# Altium schematic sheet connector_to_BMS_extension.SchDoc: foxBMS BMS-Master
size A3; DocumentNumber: 24; SheetNumber: 24; SheetTotal: 24; Author: Fraunhofer IISB foxBMS Team; REL-DATE: 2017-05-16; VERSION: 1.0.2; SheetDescription: Connectors to BMS-Extension
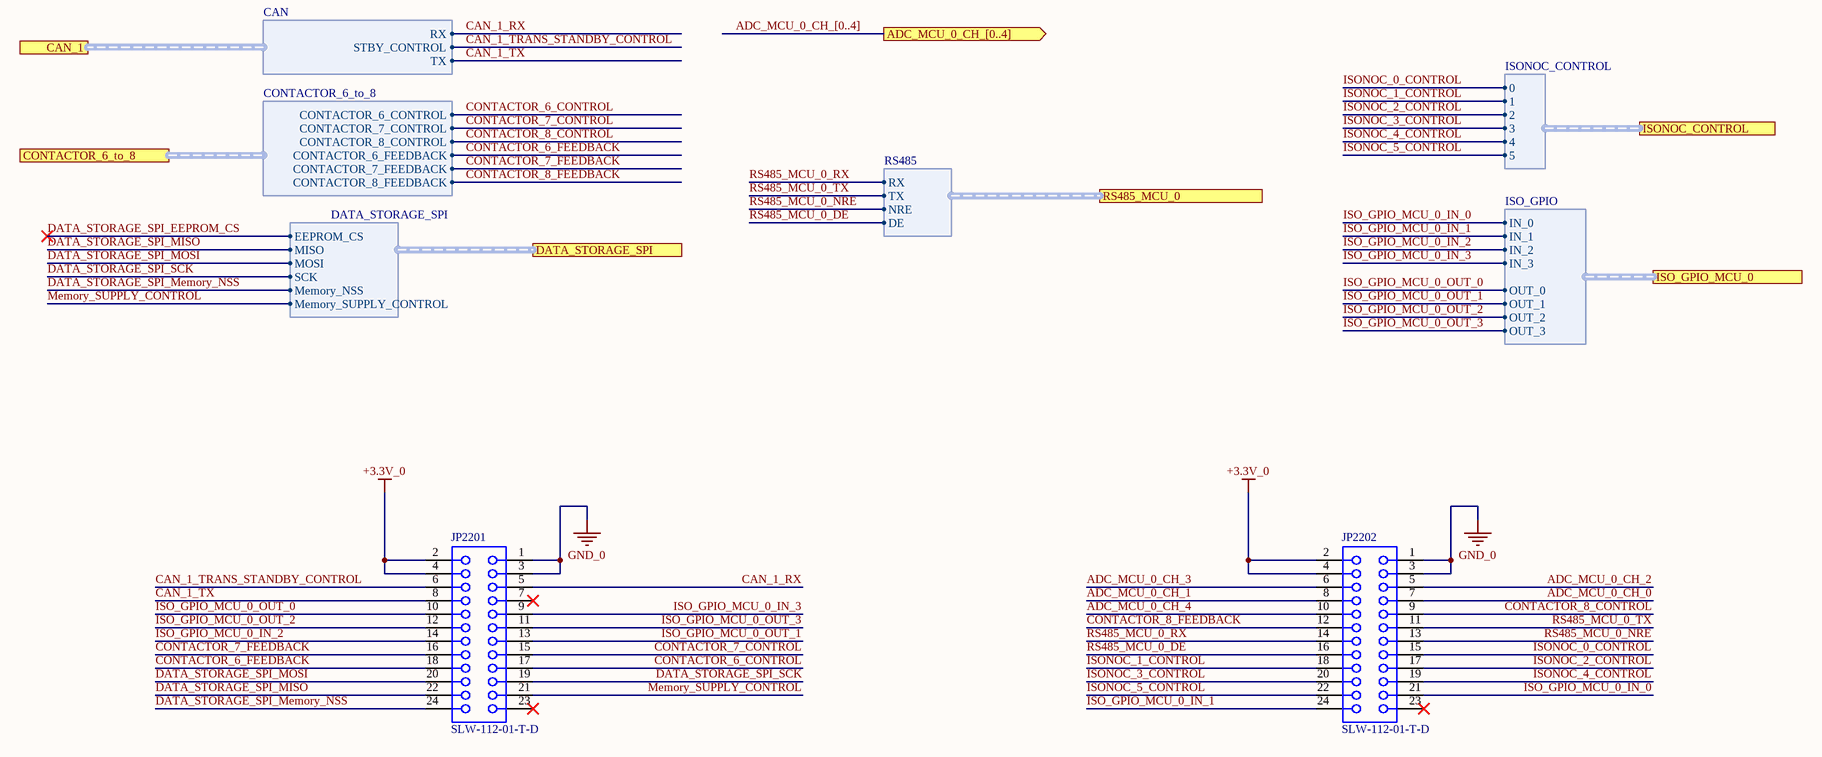
[diagram p0: connector_to_BMS_extension.SchDoc]

## Parts
JP2201  SLW-112-01-T-D  [SMTC-SLW-112-01-X-D]
JP2202  SLW-112-01-T-D  [SMTC-SLW-112-01-X-D]

## Ports
ADC_MCU_0_CH_[0..4] (out), CAN_1 (harness CAN), CONTACTOR_6_to_8 (harness CONTACTOR_6_to_8), DATA_STORAGE_SPI (harness DATA_STORAGE_SPI), ISO_GPIO_MCU_0 (harness ISO_GPIO), ISONOC_CONTROL (harness ISONOC_CONTROL), RS485_MCU_0 (harness RS485)

## Harnesses
CAN: RX, STBY_CONTROL, TX
CONTACTOR_6_to_8: CONTACTOR_6_CONTROL, CONTACTOR_7_CONTROL, CONTACTOR_8_CONTROL, CONTACTOR_6_FEEDBACK, CONTACTOR_7_FEEDBACK, CONTACTOR_8_FEEDBACK
DATA_STORAGE_SPI: EEPROM_CS, MISO, MOSI, SCK, Memory_NSS, Memory_SUPPLY_CONTROL
RS485: RX, TX, NRE, DE
ISONOC_CONTROL: 0, 1, 2, 3, 4, 5
ISO_GPIO: IN_0, IN_1, IN_2, IN_3, OUT_3, OUT_0, OUT_1, OUT_2

## Nets
+3.3V_0: JP2201.2 JP2201.4 JP2202.2 JP2202.4
GND_0: JP2201.1 JP2201.3 JP2202.1 JP2202.3
ADC_MCU_0_CH_0: JP2202.7
ADC_MCU_0_CH_1: JP2202.8
ADC_MCU_0_CH_2: JP2202.5
ADC_MCU_0_CH_3: JP2202.6
ADC_MCU_0_CH_4: JP2202.10
CAN_1_RX: JP2201.5 ; port CAN_1.RX
CAN_1_TRANS_STANDBY_CONTROL: JP2201.6 ; port CAN_1.STBY_CONTROL
CAN_1_TX: JP2201.8 ; port CAN_1.TX
CONTACTOR_6_CONTROL: JP2201.17 ; port CONTACTOR_6_to_8.CONTACTOR_6_CONTROL
CONTACTOR_6_FEEDBACK: JP2201.18 ; port CONTACTOR_6_to_8.CONTACTOR_6_FEEDBACK
CONTACTOR_7_CONTROL: JP2201.15 ; port CONTACTOR_6_to_8.CONTACTOR_7_CONTROL
CONTACTOR_7_FEEDBACK: JP2201.16 ; port CONTACTOR_6_to_8.CONTACTOR_7_FEEDBACK
CONTACTOR_8_CONTROL: JP2202.9 ; port CONTACTOR_6_to_8.CONTACTOR_8_CONTROL
CONTACTOR_8_FEEDBACK: JP2202.12 ; port CONTACTOR_6_to_8.CONTACTOR_8_FEEDBACK
DATA_STORAGE_SPI_EEPROM_CS: port DATA_STORAGE_SPI.EEPROM_CS
DATA_STORAGE_SPI_Memory_NSS: JP2201.24 ; port DATA_STORAGE_SPI.Memory_NSS
DATA_STORAGE_SPI_MISO: JP2201.22 ; port DATA_STORAGE_SPI.MISO
DATA_STORAGE_SPI_MOSI: JP2201.20 ; port DATA_STORAGE_SPI.MOSI
DATA_STORAGE_SPI_SCK: JP2201.19 ; port DATA_STORAGE_SPI.SCK
ISO_GPIO_MCU_0_IN_0: JP2202.21 ; port ISO_GPIO_MCU_0.IN_0
ISO_GPIO_MCU_0_IN_1: JP2202.24 ; port ISO_GPIO_MCU_0.IN_1
ISO_GPIO_MCU_0_IN_2: JP2201.14 ; port ISO_GPIO_MCU_0.IN_2
ISO_GPIO_MCU_0_IN_3: JP2201.9 ; port ISO_GPIO_MCU_0.IN_3
ISO_GPIO_MCU_0_OUT_0: JP2201.10 ; port ISO_GPIO_MCU_0.OUT_0
ISO_GPIO_MCU_0_OUT_1: JP2201.13 ; port ISO_GPIO_MCU_0.OUT_1
ISO_GPIO_MCU_0_OUT_2: JP2201.12 ; port ISO_GPIO_MCU_0.OUT_2
ISO_GPIO_MCU_0_OUT_3: JP2201.11 ; port ISO_GPIO_MCU_0.OUT_3
ISONOC_0_CONTROL: JP2202.15 ; port ISONOC_CONTROL.0
ISONOC_1_CONTROL: JP2202.18 ; port ISONOC_CONTROL.1
ISONOC_2_CONTROL: JP2202.17 ; port ISONOC_CONTROL.2
ISONOC_3_CONTROL: JP2202.20 ; port ISONOC_CONTROL.3
ISONOC_4_CONTROL: JP2202.19 ; port ISONOC_CONTROL.4
ISONOC_5_CONTROL: JP2202.22 ; port ISONOC_CONTROL.5
Memory_SUPPLY_CONTROL: JP2201.21 ; port DATA_STORAGE_SPI.Memory_SUPPLY_CONTROL
RS485_MCU_0_DE: JP2202.16 ; port RS485_MCU_0.DE
RS485_MCU_0_NRE: JP2202.13 ; port RS485_MCU_0.NRE
RS485_MCU_0_RX: JP2202.14 ; port RS485_MCU_0.RX
RS485_MCU_0_TX: JP2202.11 ; port RS485_MCU_0.TX

Not connected (* = marked no-connect by the designer): JP2201 7* 23*; JP2202 23*

## Buses and harness runs
bus ADC_MCU_0_CH_[0..4] = port ADC_MCU_0_CH_[0..4]

## Notes on the sheet
- Fraunhofer IISB
- Schottkystr. 10
- developed by:
- 91058 Erlangen
- Germany
- Author
- Project
- License
- Description
- File
- Version
- Release Date
- Sheet
- www.foxbms.org
- www.iisb.fraunhofer.de
- foxBMS Team
- /

## Library data of the parts
JP2201 JP2202 = CMP-1023-00145-1: Low Profile Socket Strips, Through-hole, Vertical, -55 to 105 degC, 2.54 mm Pitch, 24-Pin, Female, RoHS; Manufacturer: Samtec; Pitch: 2.54 mm; DatasheetVersion: F-214; ComponentLink3Description: Package Specification; Orientation: Vertical; ComponentLink3URL: http://www.samtec.com/documents/webfiles/cpdf/SLW-1XX-01-X-X-MKT.pdf; ComponentLink1URL: http://www.samtec.com; Temperature Range: -55 to 105 degC; PackageReference: SLW-112-01-X-D; PartNumber: SLW-112-01-T-D; ComponentLink1Description: Manufacturer URL; PackageDescription: Low Profile Socket Strip; Mounting Technology: Through-hole; ComponentLink2Description: Datasheet; RoHS: True; ComponentLink2URL: http://www.samtec.com/documents/webfiles/pdf/SLW.PDF; PackageVersion: X, 9/1987